# Altium schematic sheet amp_v2.SchDoc
size 300 x 200 mm; SheetNumber: 1; SheetTotal: 1
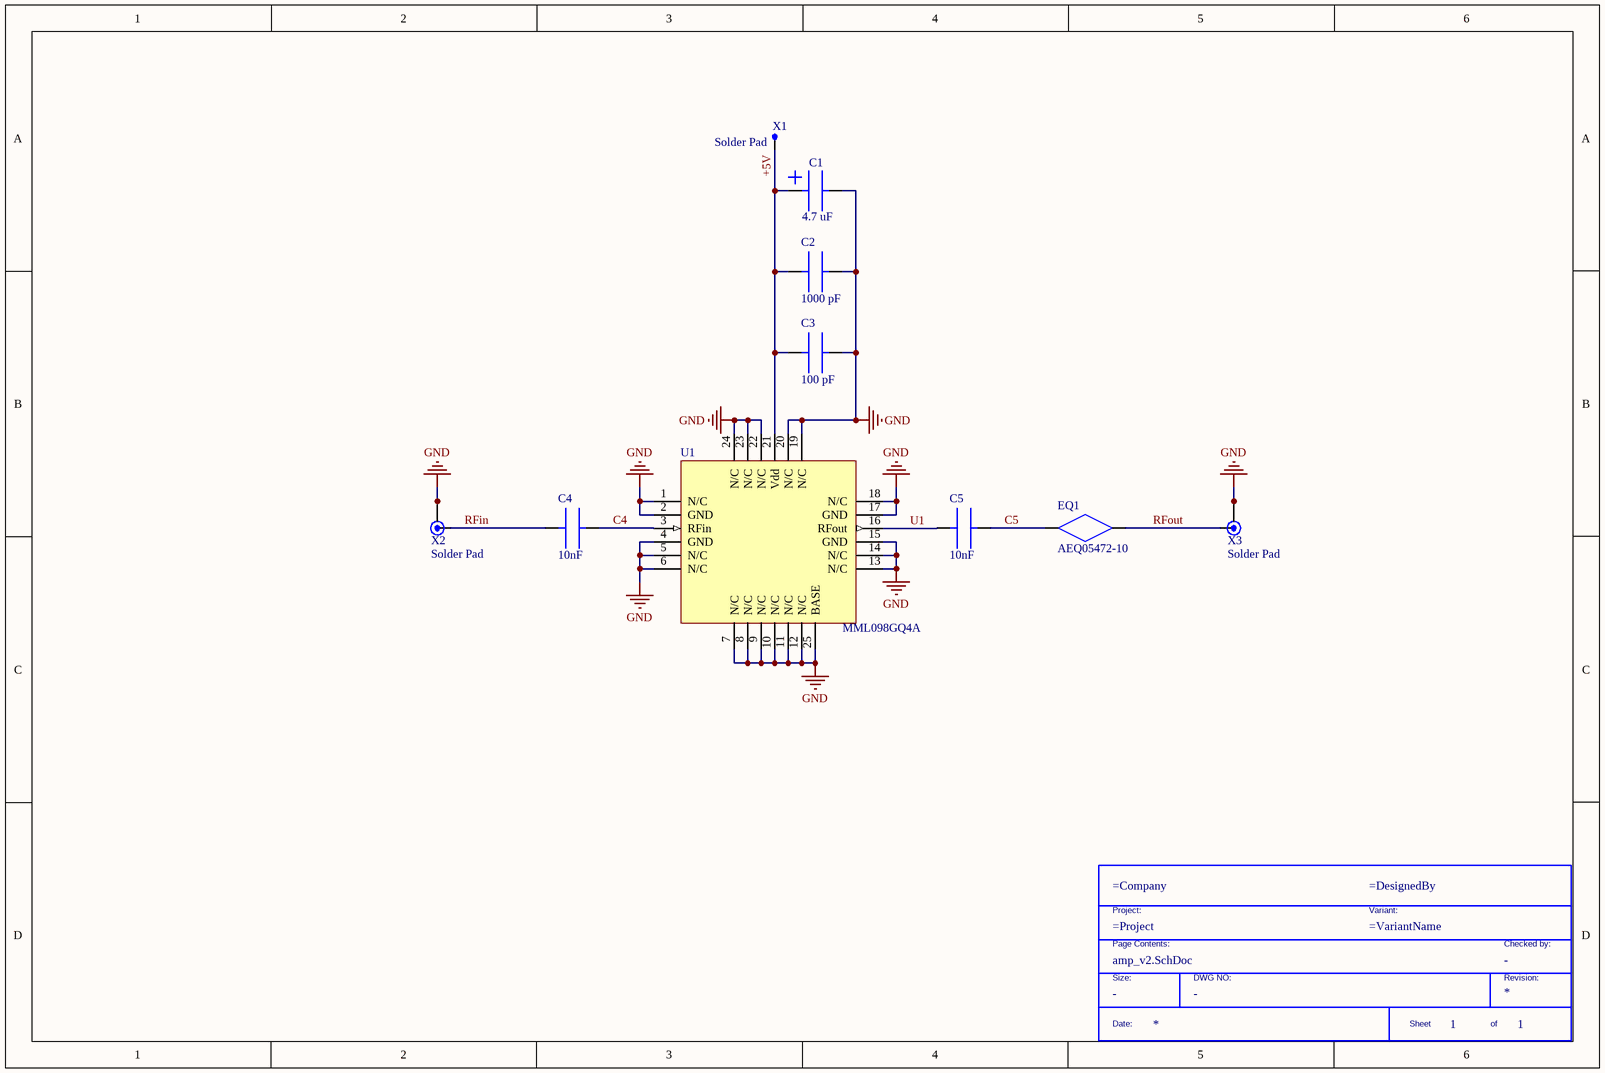
[diagram p0: amp_v2.SchDoc]

## Parts
*  TitleBlock  (value not drawn)  (graphical)
C1  4.7 uF  [C4_7uF]
C2  1000 pF  [C1000pF__C100nF]
C3  100 pF  [C100pF]
C4  10nF  [C10nF]
C5  10nF  [C10nF]
EQ1  AEQ05472-10  [EQ_AEQ05472]
U1  MML098GQ4A  [amp_MML098GQ4A]
X1  Solder Pad  [Solder Pad]
X2  Solder Pad  [CPW Edge Connector]
X3  Solder Pad  [CPW Edge Connector]

## Nets
GND: C1.2 C2.2 C3.2 U1.1(N/C) U1.2(GND) U1.4(GND) U1.5(N/C) U1.6(N/C) U1.7(N/C) U1.8(N/C) U1.9(N/C) U1.10(N/C) U1.11(N/C) U1.12(N/C) U1.13(N/C) U1.14(N/C) U1.15(GND) U1.17(GND) U1.18(N/C) U1.19(N/C) U1.20(N/C) U1.22(N/C) U1.23(N/C) U1.24(N/C) U1.25(BASE) X2.2 X2.3 X3.2 X3.3
+5V: C1.1(+) C2.1 C3.1 U1.21(Vdd) X1.1
C4: C4.2 U1.3(RFin)
C5: C5.2 EQ1.1
RFin: C4.1 X2.1
RFout: EQ1.2 X3.1
U1: C5.1 U1.16(RFout)

## Notes on the sheet
- (in symbol TitleBlock) Project:; Variant:; Page Contents:; Checked by:; Size:; DWG NO:; Revision:; Date:; Sheet; of

## Library data of the parts
* = TitleBlock: Standard Title Block; DWG NO: -; Size: -; Checked by: -
C1 = C7_4uF_TH3A475K010C2900: Tantalum Capacitor, Polarized, Tantalum (dry/solid), 10V, 10% +Tol, 10% -Tol, 4.7uF, Surface Mount, 1306; Manufacturer: Vishay Sprague; ESR (Equivalent Series Resistance): 2.9R; Leakage Current: 500nA; Ripple Current: 160mA; Tan Delta: 0.06; Reference Standard: AEC-Q200; Supplier: Future Electronics; Supplier Part Number: 4924098; Manufacturer Part Number: TH3A475K010C2900; RoHS: Yes; Category: Tantalum Capacitors; Stock: 2000; Pricing: 2000=0.178, 4000=0.175, 6000=0.173, 8000=0.171, 10000=0.166 (USD); Mounting Technology: Surface Mount; Pins: 2; Dielectric Material: Tantalum; Package Shape: Rectangular; Case/Package: 1206; Terminal Finish: Tin; Min Operating Temperature: -55°C; Max Operating Temperature: 150°C; JESD-609 Code: e3; Polarity: Polarized; Value: 4.7uF; Capacitor Type: Tantalum; Tolerance  (fill in as +-): 10%; Package Style: SMTMeter; Packaging: Tape and Reel; Tolerance (fill in as +-): 10%; Rated DC Voltage (URdc): 10V; Termination: J BEND; Length: 3.2mm; Width: 1.6mm; Height: 1.6mm; Reach SVHC Compliant: Yes; RoHS Compliant: Yes; ComponentLink1URL: https://datasheet.ciiva.com:443/pdfs/VipMasterIC/IC/VISH/VISH-S-A0010085390/VISH-S-A0010085390-1.pdf?src-supplier=IHS+Markit; ComponentLink1Description: https://datasheet.ciiva.com:443/pdfs/VipMasterIC/IC/VISH/VISH-S-A0010085390/VISH-S-A0010085390-1.pdf?src-supplier=IHS+Markit; ComponentLink2URL: https://datasheet.ciiva.com/268/th3-268785.pdf?src-supplier=Digikey; ComponentLink2Description: https://datasheet.ciiva.com/268/th3-268785.pdf?src-supplier=Digikey; ComponentLink3URL: https://datasheet.ciiva.com/16360/th3-16360891.pdf?src-supplier=Future+Electronics; ComponentLink3Description: https://datasheet.ciiva.com/16360/th3-16360891.pdf?src-supplier=Future+Electronics
C2 = C1000pF_GCM1885C1H102FA16D: Ceramic Capacitor, Multilayer, Ceramic, 50V, 1% +Tol, 1% -Tol, C0G, 30ppm/Cel TC, 0.001uF, Surface Mount, 0603; Manufacturer: Murata; Value: 1nF; Multilayer: Yes; Reference Standard: AEC-Q200; Supplier: Mouser; Supplier Part Number: 81-GCM1885C1H102FA6D; Manufacturer Part Number: GCM1885C1H102FA16D; RoHS: Yes; Category: Ceramic Capacitors; Stock: 27229; Pricing: 1=0.35, 10=0.229, 50=0.229, 100=0.138, 1000=0.092, 10000=0.074 (USD); Mounting Technology: Surface Mount; Pins: 2; Dielectric Material: Ceramic; Package Shape: Rectangular; Case/Package: 0603; Min Operating Temperature: -55°C; Max Operating Temperature: 125°C; Capacitor Type: Ceramic; Tolerance  (fill in as +-): 1%; Packaging: Tape and Reel; Tolerance (fill in as +-): 1%; Rated DC Voltage (URdc): 50V; Temperature Characteristics Code: C0G; Termination: Wraparound; Reach SVHC Compliant: Yes; RoHS Compliant: Yes; ComponentLink1URL: https://datasheet.ciiva.com:443/pdfs/VipMasterIC/IC/MURE/MURE-S-A0004370842/MURE-S-A0004372260-1.pdf?src-supplier=IHS+Markit; ComponentLink1Description: https://datasheet.ciiva.com:443/pdfs/VipMasterIC/IC/MURE/MURE-S-A0004370842/MURE-S-A0004372260-1.pdf?src-supplier=IHS+Markit
C3 = C100pF_GRM1555C2A101FA01D: Multilayer Ceramic Capacitors MLCC - SMD/SMT 100 pF 100 VDC 1% 0402 C0G (NP0); Manufacturer: Murata; Supplier: Mouser; Supplier Part Number: 81-GRM1555C2A11FA1D; Manufacturer Part Number: GRM1555C2A101FA01D; RoHS: No; Stock: 21646; Pricing: 1=0.18, 10=0.119, 50=0.119, 100=0.06, 1000=0.039, 10000=0.035 (USD)
C4 C5 = C10nF_939113733510: Manufacturer: Murata; Supplier: Mouser; Supplier Part Number: 961-939113733510; Manufacturer Part Number: 939113733510; RoHS: No; Stock: 402; Pricing: 1000=3.63, 10000=3.49 (USD)
EQ1 = EQ_AEQ05472-10: Rf Filter Gain Equalizer 2SMD; Manufacturer: Knowles Dielectric Labs; Supplier: Digikey; Supplier Part Number: 1761-1006-ND; Manufacturer Part Number: AEQ05472-10; RoHS: Yes; Stock: 390; Pricing: 10=7.145, 20=6.5195, 30=6.203, 50=5.8498, 70=5.64214, 100=5.4415, 250=5.00556, 500=4.7401, 1000=4.51981 (USD); ComponentLink1URL: http://www.mouser.com/ds/2/110/Dielectriclaboratories_EW_Series-340573.pdf?src-supplier=Mouser; ComponentLink1Description: http://www.mouser.com/ds/2/110/Dielectriclaboratories_EW_Series-340573.pdf?src-supplier=Mouser; ComponentLink2URL: http://www.knowlescapacitors.com/getattachment/69df7735-7ed2-4c4f-903b-a99acda4fa2d/Gain-Equalizers.aspx?src-supplier=Digikey; ComponentLink2Description: http://www.knowlescapacitors.com/getattachment/69df7735-7ed2-4c4f-903b-a99acda4fa2d/Gain-Equalizers.aspx?src-supplier=Digikey
U1 = amp_MML098GQ4A: Low Noise Amplifier / Low current consumption / Low noise figure / Pb-free RoHS compliant QFN package / Ultra wideband performance / Positive bias / Ready for Space Qualification; Frequency (GHz): 0.05-20.00; Gain (dB): 23.00; Noise Figure (dB): 2.3; Output P1dB (dBm): 12.00; Voltage (VDC): 5.0; Current (mA): 57; Manufacturer Part Number: MML098GQ4A
X1 = Solder Pad: Pad to solder wires to
X2 X3 = RF  CPW Solder Pad: Solder pad for RF Coplanar Waveguide Rogers 4350B Thickness 0.020" Copper 1oz